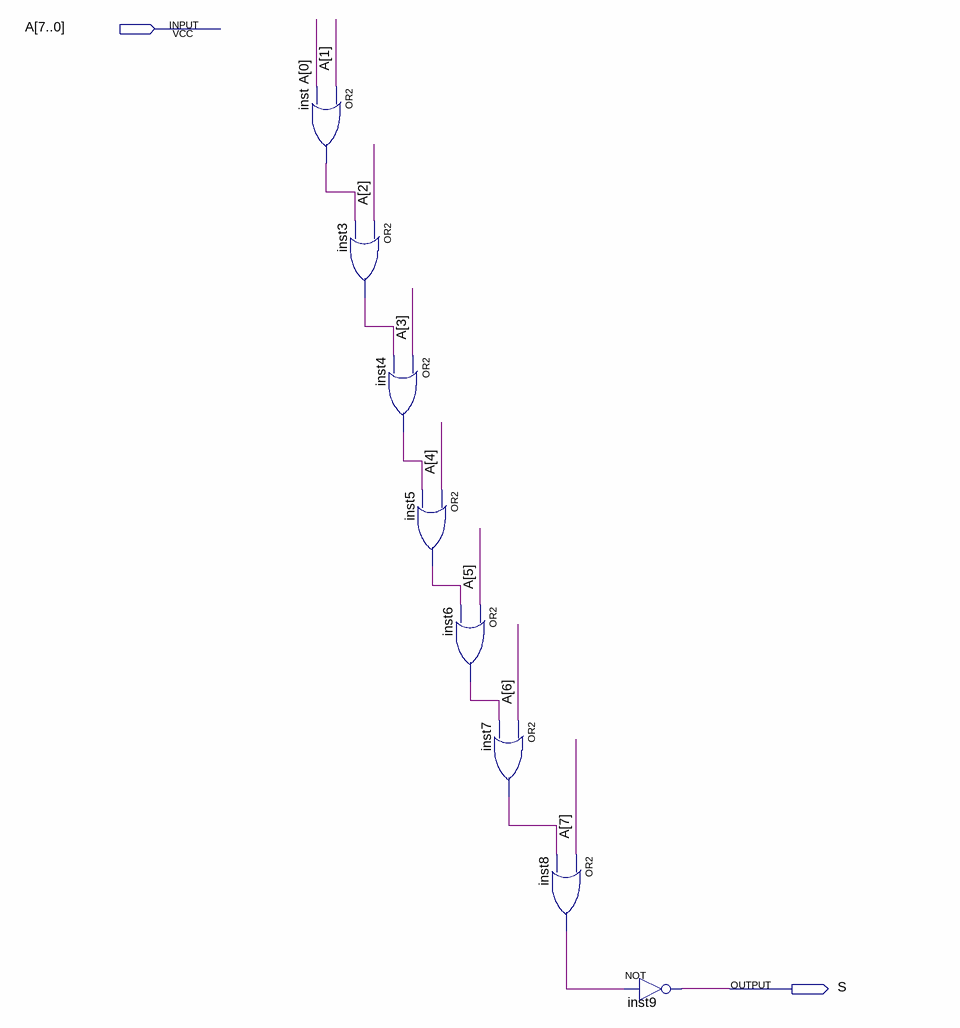
[diagram p0: schematic sheet]
// Quartus schematic isZero.bdf as structural Verilog: 8 symbols, 2 pins
module isZero (
  input  [7:0] A,
  output S
);

  wire inst3_out, inst4_out, inst5_out, inst6_out, inst7_out, inst8_out, inst_out;

  or inst (inst_out, A[1], A[0]);
  or inst3 (inst3_out, A[2], inst_out);
  or inst4 (inst4_out, A[3], inst3_out);
  or inst5 (inst5_out, A[4], inst4_out);
  or inst6 (inst6_out, A[5], inst5_out);
  or inst7 (inst7_out, A[6], inst6_out);
  or inst8 (inst8_out, A[7], inst7_out);
  not inst9 (S, inst8_out);
endmodule
